# EasyEDA Pro project STM32F103C8T6_C6T6核心板.eprj, board PCB2_TYPEC
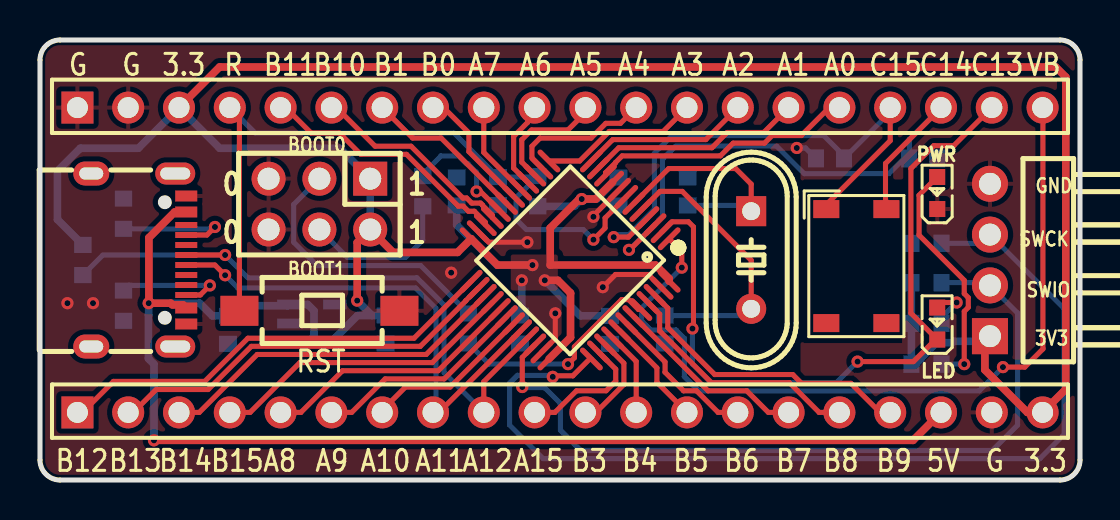
[diagram p4: board, top side]
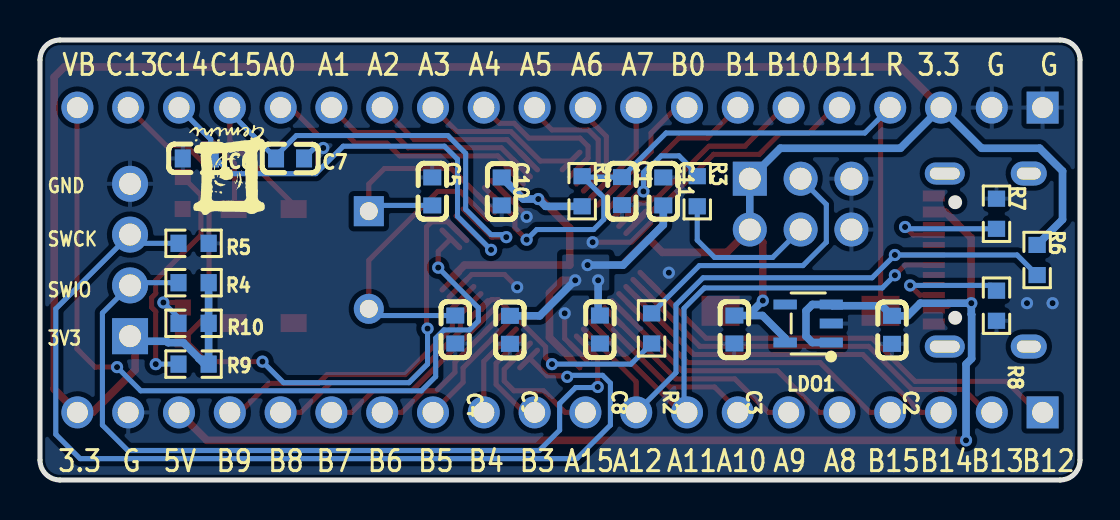
[diagram p5: board, bottom side, seen from below]

Outline 52 x 22 mm; copper layers: Top Layer, Bottom Layer. Coordinates in mm from the lower left corner of the outline.
Outline path: 0,21 0,1 arc(0.29,0.29) 1,0 51,0 arc(51.71,0.29) 52,1 52,21 arc(51.71,21.71) 51,22 1,22 arc(0.29,21.71) 0,21
Stack: Top Layer 0.035mm / Dielectric1 1.51mm FR4 er 4.5 / Bottom Layer 0.035mm

## Design rules (mm)
template: JLCPCB Capability(Two Layers Board)
spacing copperThickness1oz (default): track to track 0.102, other pairs 0.152 to 0.3
spacing copperThickness2oz: track to track 0.203, other pairs 0.152 to 0.3
track width copperThickness1oz (default): min 0.127, default 0.254, max 2.54
track width copperThickness2oz: min 0.203, default 0.254, max 2.54
differential pair differentialPair (default): width min 0.127, default 0.254, max 2.54; gap min 0.152, default 0.152
via viaSize (default): diameter min 0.5, default 0.61, max 10; hole min 0.3, default 0.305, max 6.3

## Placement (name value [footprint] x y rotation side)
C1  1uF  [C0603]  22.9 14.44 90 bottom
C2  1uF  [C0603]  9.4 7.51 90 bottom
C3  1uF  [C0603]  17.28 7.52 90 bottom
C4  20pF  [C0603]  31.24 7.52 90 bottom
C5  20pF  [C0603]  32.38 14.43 270 bottom
C6  6pF  [C0603]  44.16 16.08 180 bottom
C7  6pF  [C0603]  39.5 16.08 0 bottom
C8  100nF  [C0603]  24 7.52 90 bottom
C9  100nF  [C0603]  28.5 7.51 90 bottom
C10  100nF  [C0603]  28.92 14.43 90 bottom
C11  100nF  [C0603]  20.83 14.43 270 bottom
H1  PZ254V-12-6P  [HDR-TH_6P-P2.54-V-M-R2-C3-S2.54]  13.97 13.79 180 top
H2  PZ254R-11-04P  [HDR-TH_4P-P2.54-H-M-W10.4]  47.5 11 90 top
LDO1  ME6211C33M5G-N  [SOT-23-5_L3.0-W1.7-P0.95-LS2.8-BL]  13.59 7.83 90 bottom
LED  -  [LED_0603]  44.85 7.87 90 top
PWR  -  [LED_0603]  44.85 14.4 90 top
R1  10kΩ  [R0603]  24.89 14.44 270 bottom
R2  100kΩ  [R0603]  21.42 7.58 90 bottom
R3  100kΩ  [R0603]  19.14 14.44 90 bottom
R4  10kΩ  [R0603]  44.32 9.87 180 bottom
R5  10kΩ  [R0603]  44.32 11.83 0 bottom
R6  1.5kΩ  [R0603]  2.14 11 90 bottom
R7  5.1kΩ  [R0603]  4.17 13.31 270 bottom
R8  5.1kΩ  [R0603]  4.17 8.71 90 bottom
R9  510Ω  [R0603]  44.32 5.79 0 bottom
R10  510Ω  [R0603]  44.32 7.83 0 bottom
SW1  TS-1101-C-W  [SW-SMD_L6.0-W3.3-LS8.0]  13.97 8.46 180 top
U1  STM32F103C8T6  [LQFP-48_L7.0-W7.0-P0.50-LS9.0-BL]  26.51 11 135 top
U2  ZX-PZ2.54-1-20PZZ  [HDR-TH_20P-P2.54-V-M]  26 3.38 0 top
U3  ZX-PZ2.54-1-20PZZ  [HDR-TH_20P-P2.54-V-M]  26 18.62 0 top
USB1  TYPE-C 16PIN 2MD(073)  [USB-C-SMD_TYPE-C-6PIN-2MD-073]  4.94 11 270 top
X1  8MHz  [HC-49US_L11.5-W4.5-P4.88]  35.56 11 270 top
X2  32.768kHz  [MC-306_4P-L8.0-W3.2-P5.5-BL]  40.89 11 270 top

## Footprints (pads in the part's own frame, mm; a bottom-side part is the same pattern mirrored in y, then rotated)
C0603
  rect 0.8x0.9 smd: 1(-0.7,0) 2(0.7,0)
HC-49US_L11.5-W4.5-P4.88
  rect 1.501x1.501 hole 0.899: 1(-2.441,0)
  round 1.501 hole 0.899: 2(2.441,0)
HDR-TH_4P-P2.54-H-M-W10.4
  rect 1.8x1.8 hole 1.1: 1(-3.81,0)
  round 1.8 hole 1.1: 2(-1.27,0) 3(1.27,0) 4(3.81,0)
HDR-TH_6P-P2.54-V-M-R2-C3-S2.54
  rect 1.7x1.7 hole 1.1: 1(-2.54,-1.27)
  round 1.7 hole 1.1: 2(-2.54,1.27) 3(0,-1.27) 4(0,1.27) 5(2.54,-1.27) 6(2.54,1.27)
HDR-TH_20P-P2.54-V-M
  rect 1.6x1.6 hole 1.05: 1(-24.13,0)
  round 1.6 hole 1.05: 2(-21.59,0) 3(-19.05,0) 4(-16.51,0) 5(-13.97,0) 6(-11.43,0) 7(-8.89,0) 8(-6.35,0) 9(-3.81,0) 10(-1.27,0) 11(1.27,0) 12(3.81,0) 13(6.35,0) 14(8.89,0) 15(11.43,0) 16(13.97,0) 17(16.51,0) 18(19.05,0) 19(21.59,0) 20(24.13,0)
LED_0603
  rect 0.8x0.8 smd: 1(-0.851,-0.01) 2(0.75,-0.005)
LQFP-48_L7.0-W7.0-P0.50-LS9.0-BL
  oval 0.27x1.5 smd: 1(-2.75,-4.25) 2(-2.25,-4.25) 3(-1.75,-4.25) 4(-1.25,-4.25) 5(-0.75,-4.25) 6(-0.25,-4.25) 7(0.25,-4.25) 8(0.75,-4.25) 9(1.25,-4.25) 10(1.75,-4.25) 11(2.25,-4.25) 12(2.75,-4.25) 25(2.75,4.25) 26(2.25,4.25) 27(1.75,4.25) 28(1.25,4.25) 29(0.75,4.25) 30(0.25,4.25) 31(-0.25,4.25) 32(-0.75,4.25) 33(-1.25,4.25) 34(-1.75,4.25) 35(-2.25,4.25) 36(-2.75,4.25)
  oval 1.5x0.27 smd: 13(4.25,-2.75) 14(4.25,-2.25) 15(4.25,-1.75) 16(4.25,-1.25) 17(4.25,-0.75) 18(4.25,-0.25) 19(4.25,0.25) 20(4.25,0.75) 21(4.25,1.25) 22(4.25,1.75) 23(4.25,2.25) 24(4.25,2.75) 37(-4.25,2.75) 38(-4.25,2.25) 39(-4.25,1.75) 40(-4.25,1.25) 41(-4.25,0.75) 42(-4.25,0.25) 43(-4.25,-0.25) 44(-4.25,-0.75) 45(-4.25,-1.25) 46(-4.25,-1.75) 47(-4.25,-2.25) 48(-4.25,-2.75)
MC-306_4P-L8.0-W3.2-P5.5-BL
  rect 0.899x1.3 smd: 1(-2.545,-1.577) 2(3.155,-1.577) 3(3.155,1.425) 4(-2.545,1.425)
R0603
  rect 0.806x0.864 smd: 1(-0.753,0) 2(0.753,0)
SOT-23-5_L3.0-W1.7-P0.95-LS2.8-BL
  rect 0.49x1.157 smd: 1(-0.95,-1.153) 2(0,-1.153) 3(0.95,-1.153)
  rect 0.49x1.175 smd: 4(0.95,1.153) 5(-0.95,1.153)
SW-SMD_L6.0-W3.3-LS8.0
  rect 1.9x1.5 smd: 1(-4,0) 2(4,0)
USB-C-SMD_TYPE-C-6PIN-2MD-073
  rect 0.55x1.1 smd: 1(-3.2,2.375) 2(-2.4,2.375) 11(2.4,2.375) 12(3.2,2.375)
  rect 0.3x1.1 smd: 3(-1.75,2.375) 4(-1.25,2.375) 5(-0.75,2.375) 6(-0.25,2.375) 7(0.25,2.375) 8(0.75,2.375) 9(1.25,2.375) 10(1.75,2.375)
  oval 1.1x2 hole 0.6x1.5: 13(-4.325,1.825) 14(4.325,1.825)
  oval 1.2x1.8 hole 0.6x1.2: 13(-4.325,-2.375) 14(4.325,-2.375)

## Nets
As in the schematic, except:
3V3: C3.2 C8.2 C9.2 C10.2 C11.2 H1.1 H1.2 H2.1 LDO1.5 R1.2 R4.2 R6.2 R9.1 R10.1 U1.9 U1.24 U1.36 U1.48 U2.20 U3.3
5V: C2.2 LDO1.1 LDO1.3 U2.18 USB1.2 USB1.11
GND: C1.1 C2.1 C3.1 C4.1 C5.1 C6.1 C7.1 C8.1 C9.1 C10.1 C11.1 H1.5 H1.6 H2.4 LDO1.2 PWR.1 R5.1 R7.1 R8.1 SW1.1 U1.8 U1.23 U1.35 U1.47 U2.19 U3.1 U3.2 USB1.1 USB1.12
PC13: LED.1 U1.2 U3.19
$1N6167: PWR.2 R9.2
$1N6168: LED.2 R10.2

Pads without a net: LDO1 4; USB1 3 5 8 9 13 14; X2 2 3

## Via types
v1: diameter 0.61, hole 0.305, Top Layer to Bottom Layer, 32 vias

## Routing (per net, layer and track width the routed paths; a pad name or vN(x,y) marks a point on that pad's centre or on a via; arc(x,y) is an arc through that point)
3V3: length 153.1
  Top Layer w0.381: U3.3 8.98,20.65 50.78,20.65 51.29,20.14 51.29,4.54 U2.20 49.37,3.38 47.24,5.5 47.24,6.94 H2.1 ; U1.36 26.53,7.13 26.53,9.35 25.89,9.98 v1(25.24,9.98) ; v1(15.86,8.97) 15.86,11.87 H1.2 17.65,11.38 20.88,11.38 U1.24 22.87,10.75 v1(24.62,10.75) ; U1.48 31.46,10.07 30.78,10.75 25.51,10.75 25.51,12.6 26.96,14.05 v1(27.09,14.05) 27.79,14.05 28.63,14.89
  Bottom Layer w0.381: C9.2 27.01,8.21 v1(25.24,9.98) ; 16.6,8.22 15.88,8.22 14.74,7.09 LDO1.5 ; 16.6,8.22 v1(15.86,8.97) ; 16.6,8.22 C3.2 ; C10.2 27.84,14.05 v1(27.09,14.05) 26.72,13.68 R1.2 ; H1.2 H1.1 14.99,16.59 8.98,16.59 U3.3 4.92,16.59 2.02,16.59 0.87,15.44 0.87,13.02 R6.2 ; H2.1 47.24,6.94 45.66,6.94 45.6,6.87 44.83,6.87 44.05,6.09 44.05,6.07 43.78,5.79 R9.1 R10.1 R4.2 ; v1(24.09,9.98) 24.09,8.31 C8.2 ; C11.2 20.83,12.76 22.84,10.75 v1(24.62,10.75)
5V: length 66.1
  Top Layer w0.381: USB1.11 7.16,8.76 6.62,8.76 6.54,8.84 v1(5.43,8.84) 5.44,8.85 5.44,12.11 6.73,13.4 USB1.2 ; v1(5.7,1.98) 43.65,1.98 U2.18
  Bottom Layer w0.381: v1(5.7,1.98) 5.7,5.79 5.42,6.07 5.42,8.27 5.43,8.28 v1(5.43,8.84) 7.98,8.84 8.62,8.21 C2.2 9.9,8.71 12.37,8.71 LDO1.3 13.38,8.78 13.7,8.46 13.7,7.19 13.38,6.88 LDO1.1
GND: length 11.5
  Top Layer w0.254: v1(24.37,11.89) 22.44,11.89 U1.23 ; v1(25.76,8.33) 25.76,7.08 U1.35 ; v1(27.67,13.16) 27.67,13.22 28.98,14.54 ; v1(28.14,9.64) 28.78,10.28 30.41,10.28 U1.47
  Bottom Layer w0.254: 38.8,16.08 38.28,16.6 v1(37.84,16.6)
  vias: v1(1.37,8.84) v1(2.65,8.84) v1(20.56,10.36)
BOOT0: length 10.9
  Top Layer w0.254: v1(26.4,5.79) 26.72,6.11 26.72,6.66 29.08,9.02 29.43,9.02 29.92,8.53 30.04,8.53
  Bottom Layer w0.254: R2.1 22.45,5.79 v1(26.4,5.79)
BOOT1: length 6
  Top Layer w0.254: v1(21.83,14.43) 22.02,14.43 22.97,13.47
  Bottom Layer w0.254: v1(21.83,14.43) 21.83,15.38 21.4,15.81 21.34,15.81 20.94,16.21 20.05,16.21 19.14,15.29 R3.2
D+: length 32.3
  Top Layer w0.254: USB1.6 v1(9.25,11.25) ; 24.39,7.11 22.19,4.91 U2.9
  Bottom Layer w0.254: R6.1 3.15,11.25 v1(9.25,11.25) 10.39,10.11 18.85,10.11 20.2,8.76 20.2,5.37 U2.9
D-: length 24.7
  Top Layer w0.254: USB1.7 8.74,10.75 v1(9.25,10.24) ; 24.03,7.46 19.95,3.38 U2.8
  Bottom Layer w0.254: U2.8 19.8,3.53 19.8,8.59 18.78,9.6 9.89,9.6 v1(9.25,10.24)
OSC32_IN: length 29.5
  Top Layer w0.254: v1(29.45,11.51) 29.49,11.51 U1.3 ; U3.18 44.92,18.49 44.92,18.47 42.28,15.83 42.28,13.97 42.39,13.85
  Bottom Layer w0.254: C6.2 43.46,17.03 U3.18 ; v1(29.45,11.51) 31.12,13.18 31.12,16.04 31.78,16.69 36.84,16.69 38.21,15.32 42.45,15.32 43.21,16.08
OSC32_OUT: length 27.5
  Top Layer w0.254: 39.39,13.85 42.51,16.97 U3.17 ; 30.4,13.12 29.42,12.14 v1(28.69,12.14)
  Bottom Layer w0.254: U3.17 42.51,18.39 C7.2 40.2,16.21 39.18,17.22 31.61,17.22 30.72,16.33 30.72,13.54 29.45,12.27 28.81,12.27 v1(28.69,12.14)
OSC_IN: length 14.2
  Top Layer w0.254: 30.04,13.47 31,14.43 32.12,14.43 35.56,10.98 X1.2
  Bottom Layer w0.254: X1.2 35.22,8.22 C4.2
OSC_OUT: length 11.6
  Top Layer w0.254: U1.6 31.43,15.57 34.78,15.57 35.56,14.79 X1.1
  Bottom Layer w0.254: X1.1 35.27,13.73 C5.2
PA0: length 13.3
  Top Layer w0.254: U3.16 39.84,18.75 39.59,18.75 38.06,17.22 36.61,17.22 36.23,16.84 34.66,16.84 34.02,16.21 29.11,16.21 28.77,15.87 28.77,15.86 28.28,15.36 U1.10
PA1: length 10.8
  Top Layer w0.254: U1.11 28.94,16.61 33.6,16.61 34.36,17.38 36.19,17.38 U3.15
PA2: length 8.4
  Top Layer w0.254: U1.12 28.64,17.02 33.29,17.02 U3.14
PA3: length 8
  Top Layer w0.254: U3.13 31.16,17.43 28.46,17.43 26.98,15.95 U1.13
PA4: length 7.3
  Top Layer w0.254: U3.12 29.02,17.83 28.29,17.83 27.55,17.1 25,17.1 24.6,16.69 24.6,16.09 U1.14
PA5: length 6
  Top Layer w0.254: U1.15 24.09,15.89 24.09,17.01 24.58,17.5 26.4,17.5 27.27,18.37 U3.11
PA6: length 4.5
  Top Layer w0.254: 24.39,14.89 23.68,15.59 23.68,17.18 24.39,17.88 24.39,18.28 U3.10
PA7: length 4.8
  Top Layer w0.254: 24.03,14.54 22.19,16.38 U3.9
PA8: length 13.1
  Top Layer w0.254: U2.5 13.04,3.38 15.13,5.46 19.91,5.46 22.97,8.53
PA9: length 10.7
  Top Layer w0.254: U2.6 15.58,3.38 17.26,5.06 20.21,5.06 U1.30
PA10: length 8.5
  Top Layer w0.254: U2.7 17.11,3.49 18.27,4.65 20.51,4.65 U1.31
PA13: length 39.8
  Top Layer w0.254: U1.34 24.11,6.13 v1(24.11,4.65)
  Bottom Layer w0.254: R4.1 47.36,9.87 H2.2 48.88,8.35 48.88,2.75 47.61,1.47 27.03,1.47 26.02,2.49 26.02,3.82 25.22,4.62 24.39,4.62 24.37,4.65 v1(24.11,4.65)
PA14: length 49.8
  Top Layer w0.254: U1.37 27.48,6.05 26.64,5.21 25.69,5.21 v1(25.64,5.16)
  Bottom Layer w0.254: R5.2 47.06,11.83 H2.3 51.21,8.56 51.21,2.28 50,1.07 25.16,1.07 23.48,2.75 23.48,4.84 23.87,5.23 25.56,5.23 v1(25.64,5.16)
PA15: length 6.5
  Top Layer w0.254: U2.10 25.74,3.38 26.82,4.46 28.3,4.46 28.79,4.95 28.79,5.54 U1.38
PB0: length 6.4
  Top Layer w0.254: U1.18 21.45,16.41 21.45,17.35 20.18,18.62 U3.8
PB1: length 8.2
  Top Layer w0.254: U1.19 20.06,17.1 18.63,17.1 U3.7
PB3: length 4.9
  Top Layer w0.254: U2.11 27.8,3.38 29.19,4.78 29.19,5.84 U1.39
PB4: length 4.2
  Top Layer w0.254: U2.12 29.81,5.93 28.63,7.11
PB5: length 5.5
  Top Layer w0.254: U2.13 30.84,4.89 30.84,5.6 28.98,7.46
PB6: length 7.7
  Top Layer w0.254: U2.14 33.91,3.38 32.83,4.46 32.18,4.46 31.25,5.39 31.25,5.9 U1.42
PB7: length 9.7
  Top Layer w0.254: U2.15 36.42,3.38 35.34,4.46 33.4,4.46 U1.43
PB8: length 12.3
  Top Layer w0.254: U2.16 38.96,3.38 37.47,4.87 33.57,4.87 30.98,7.45 30.98,8.29 30.4,8.88
PB9: length 14.8
  Top Layer w0.254: U1.46 31.39,8.59 31.39,7.62 33.74,5.27 37.64,5.27 38.08,4.83 40.55,4.83 42,3.38 U2.17
PB10: length 10.4
  Top Layer w0.254: U3.6 14.82,18.62 16.75,16.69 18.55,16.69 21.14,14.1 21.33,14.1 21.59,13.84 22.03,13.84 22.12,13.75 22.12,13.74 22.62,13.24 22.62,13.12
PB11: length 12.7
  Top Layer w0.254: U1.22 22.27,12.89 21.72,13.44 21.42,13.44 21.16,13.69 20.91,13.69 18.32,16.28 16.04,16.28 14.97,17.35 13.55,17.35 12.28,18.62 U3.5
PB12: length 22.4
  Top Layer w0.254: U2.1 2.12,3.38 3.67,4.93 8.24,4.93 10.4,7.09 18.7,7.09 21.55,9.94 U1.25
PB13: length 20.1
  Top Layer w0.254: U2.2 4.66,3.38 5.81,4.52 8.41,4.52 10.56,6.68 19.01,6.68 21.29,8.96 21.29,8.97 21.91,9.59 U1.26
PB14: length 17.7
  Top Layer w0.254: U2.3 7.96,3.38 10.86,6.28 19.31,6.28 U1.27
PB15: length 15.4
  Top Layer w0.254: 22.62,8.88 19.61,5.87 12.99,5.87 10.5,3.38 U2.4
PC13: length 36.7
  Top Layer w0.254: v1(40.88,5.92) 43.67,5.92 44.77,7.02 44.87,7.02 43.54,8.34 43.54,15.57 44.69,16.72 45.69,16.72 U3.19 ; v1(32.62,7.57) 32.67,7.62 32.67,12.66 32.42,12.91 31.6,12.91 U1.2
  Bottom Layer w0.254: v1(40.88,5.92) 39.82,4.87 33.55,4.87 32.62,5.79 v1(32.62,7.57)
RST: length 36.9
  Top Layer w0.254: SW1.2 9.97,18.14 U3.4 ; v1(27.67,12.02) 28.25,12.6 28.25,13.1 U1.7
  Bottom Layer w0.254: 24.85,15.14 24,14.3 23.99,14.3 23.81,14.12 23.81,13.03 24.32,12.52 27.16,12.52 v1(27.67,12.02) ; 24.85,15.14 R1.1 ; 24.85,15.14 C1.2 20.7,17.35 10.76,17.35 U3.4
VB: length 40.8
  Top Layer w0.254: v1(48.15,5.64) 49.24,5.64 50.15,6.56 50.15,18.22 50.13,18.24 U3.20 ; v1(32.09,10.62) 32.09,11.43 U1.1
  Bottom Layer w0.254: v1(32.09,10.62) 30.08,8.61 30.08,7.95 30.53,7.5 31.8,7.5 32.22,7.09 32.22,5.17 32.93,4.46 46.96,4.46 v1(48.15,5.64)
$1N6165: length 13.9
  Bottom Layer w0.254: H1.3 12.68,13.78 12.68,11.89 13.85,10.72 19.03,10.72 R2.2
$1N6166: length 7.8
  Bottom Layer w0.254: R3.1 19.14,11.99 18.27,11.13 15.37,11.13 H1.4
$1N6167: length 12
  Top Layer w0.254: 44.86,15.15 43.95,14.24 43.95,12.24 46.21,9.98 46.21,9.32 46.41,9.12 46.41,8.63 46.21,8.43 v1(46.21,5.79)
  Bottom Layer w0.254: R9.2 v1(46.21,5.79)
$1N6168: length 2.4
  Top Layer w0.254: v1(45.83,8.88) 45.11,8.88 LED.2
  Bottom Layer w0.254: v1(45.83,8.88) 45.08,8.12 R10.2
$1N6851: length 5.8
  Top Layer w0.254: v1(8.49,9.73) 8.01,9.25 USB1.10
  Bottom Layer w0.254: R8.2 4.44,9.73 v1(8.49,9.73)
$1N6852: length 6.2
  Top Layer w0.254: v1(8.75,12.65) 8.35,12.25 USB1.4
  Bottom Layer w0.254: v1(8.75,12.65) 8.66,12.56 R7.2

## Copper pours and planes (outline as drawn; the poured copper is in the pictures)
3V3 on Top Layer: 23.54,11.27 25.89,11.27 25.89,9.48 23.54,9.48
3V3 on Bottom Layer: 23.54,11.27 25.89,11.27 25.89,9.48 23.54,9.48
GND on Top Layer: -0.78,23.57 53.58,23.57 53.58,-1.06 -0.78,-1.06
GND on Bottom Layer: -1.54,23.57 54.85,23.57 54.85,-1.83 -1.54,-1.83

## Text on the board
Bottom Silkscreen Layer: GND | SWCK | SWIO | 3V3 | G | 3.3 | R | B11 | B10 | B1 | B0 | A7 | A6 | A5 | A4 | A3 | A2 | A1 | A0 | C15 | C14 | C13 | VB | B12 | B13 | B14 | B15 | A8 | A9 | A10 | A11 | A12 | A15 | B3 | B4 | B5 | B6 | B7 | B8 | B9 | 5V
Top Silkscreen Layer: BOOT0 | BOOT1 | SWCK | SWIO | 3V3 | GND | B12 | G | B13 | B14 | 3.3 | B15 | R | A8 | B11 | RST | B10 | A9 | A10 | B1 | A11 | B0 | A12 | A7 | A15 | A6 | A5 | B3 | A4 | B4 | A3 | B5 | A2 | B6 | B7 | A1 | B8 | A0 | C15 | B9 | C14 | 5V | C13 | VB | 0 | 1
